# Altium schematic sheet DCDC_converters.SchDoc
size A4; Organization: EPFL; DocumentNumber: 1; Revision: 1; SheetNumber: 1; SheetTotal: 1
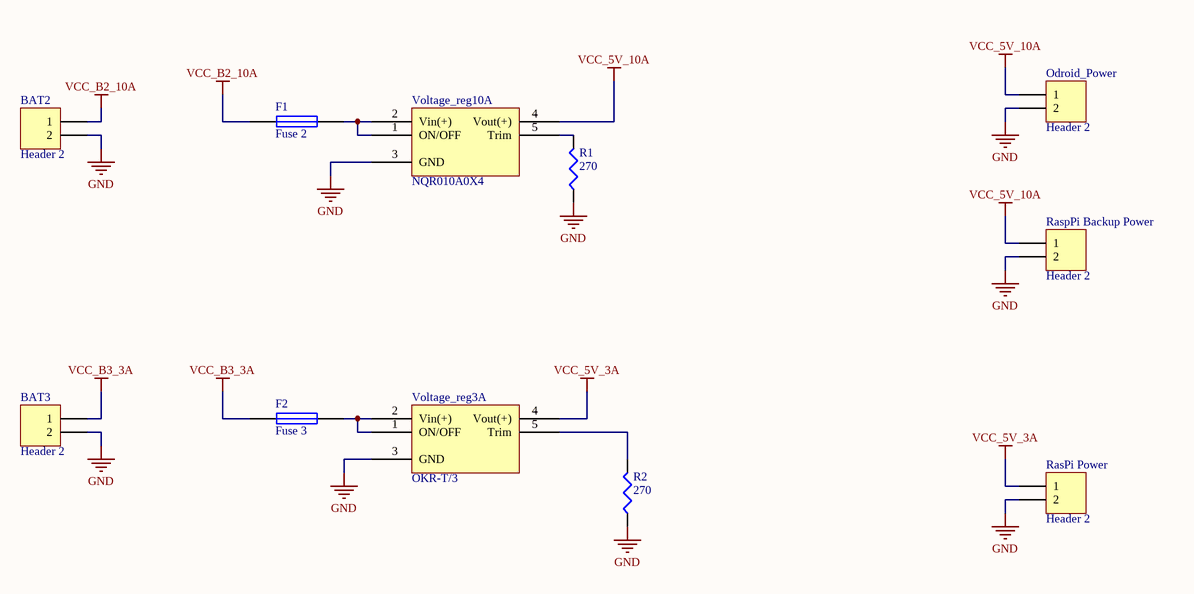
[diagram p0: DCDC_converters.SchDoc]

## Parts
BAT2  Header 2  [STL1550/2-3.5]
BAT3  Header 2  [STL1550/2-3.5]
F1  Fuse 2  [FUSE_22.5MM]
F2  Fuse 3  [FUSE_22.5MM]
Odroid_Power  Header 2  [STL1550/2-3.5]
R1  270  [0805_G]
R2  270  [0805_G]
RasPi_Power  Header 2  [STL1550/2-3.5]
RaspPi_Backup_Power  Header 2  [STL1550/2-3.5]
Voltage_reg3A  OKR-T/3  [DC_Converter_3A]
Voltage_reg10A  NQR010A0X4  [DC_Converter_10A]

## Nets
GND: BAT2.2 BAT3.2 Odroid_Power.2 R1.1 R2.1 RasPi_Power.2 RaspPi_Backup_Power.2 Voltage_reg3A.3(GND) Voltage_reg10A.3(GND)
VCC_5V_3A: RasPi_Power.1 Voltage_reg3A.4(Vout(+))
VCC_5V_10A: Odroid_Power.1 RaspPi_Backup_Power.1 Voltage_reg10A.4(Vout(+))
VCC_B2_10A: BAT2.1 F1.1
VCC_B3_3A: BAT3.1 F2.1
NetF1_2: F1.2 Voltage_reg10A.1(ON/OFF) Voltage_reg10A.2(Vin(+))
NetF2_2: F2.2 Voltage_reg3A.1(ON/OFF) Voltage_reg3A.2(Vin(+))
NetR1_2: R1.2 Voltage_reg10A.5(Trim)
NetR2_2: R2.2 Voltage_reg3A.5(Trim)

## Notes on the sheet
- Title
- Size:
- Date:
- A4
- Number:
- Time:
- Revision:
- Sheet
- of
- File:

## Library data of the parts
BAT2 BAT3 Odroid_Power RasPi_Power RaspPi_Backup_Power = Header 2: Header, 2-Pin; LatestRevisionDate: 17-Jul-2002; LatestRevisionNote: Re-released for DXP Platform.; Publisher: Altium Limited
F1 F2 = Fuse 1: Fuse; Published: 8-Jun-2000; LatestRevisionDate: 17-Jul-2002; LatestRevisionNote: Re-released for DXP Platform.; PackageReference: PIN-W2/E2.8; Publisher: Altium Limited; PackageDescription: Thru-Hole; 2 Leads
R1 R2 = Res3: Resistor; Value: 1K; Published: 8-Jun-2000; LatestRevisionDate: 29-May-2009; LatestRevisionNote: IPC-7351 Footprint Added.; PackageReference: J1-0603; Publisher: Altium Limited; PackageDescription: Chip Resistor
Voltage_reg3A = OKR-T/3: DCDC Converter 3Amps
Voltage_reg10A = NQR010A0X4: DCDC Converter 10Amps; Mfr: LINEAGE POWER